# Altium schematic sheet RX_USB.SchDoc
size 431 x 279 mm; Organization: ORGANIZATION; Address1: ADDRESS 1; Address2: ADDRESS 2; Address3: ADDRESS 3; Address4: ADDRESS 4; Revision: -; SheetNumber: 1; SheetTotal: 6; ENG_APP_DATE: --/--/--; DSN_APP_DATE: --/--/--; CHK_APP_DATE: --/--/--
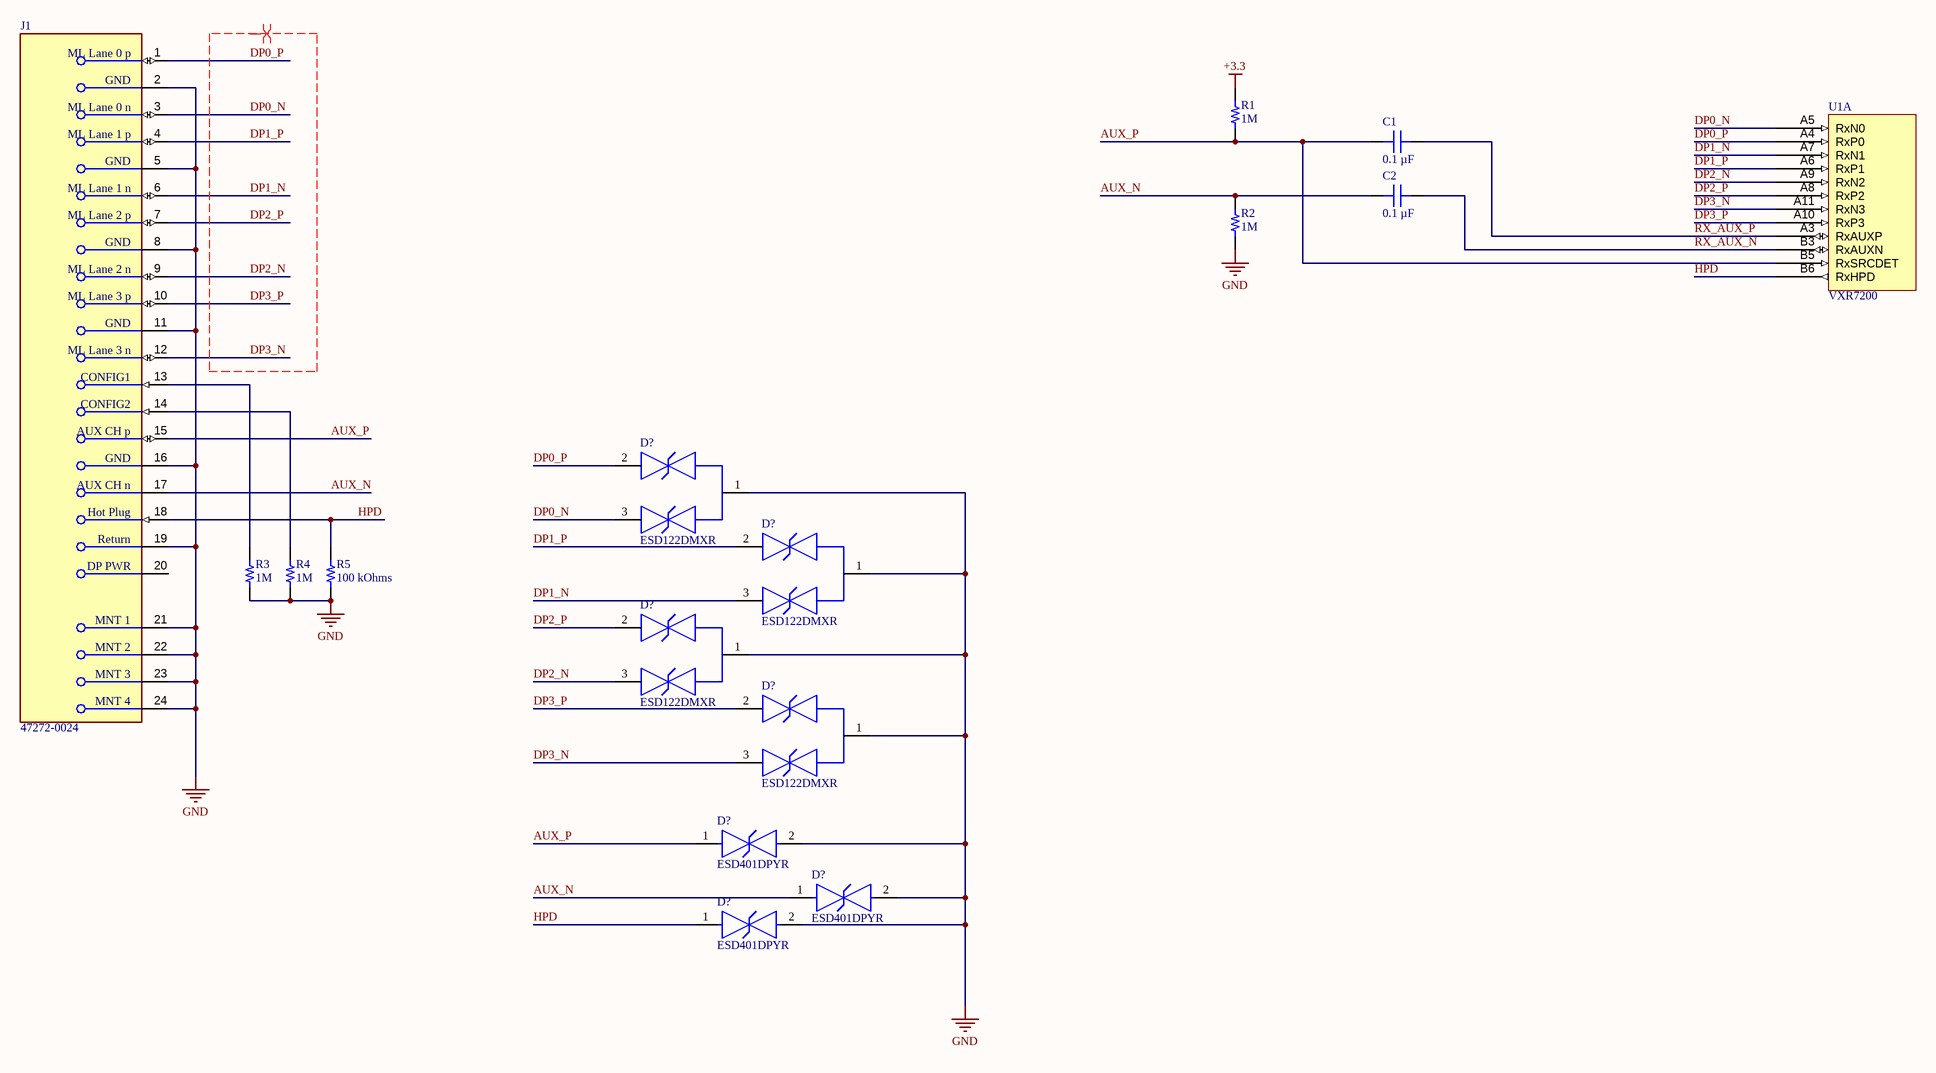
[diagram p0: RX_USB.SchDoc]

## Parts
(Parts that share a designator on the sheet are numbered #1, #2 ... from top to bottom, then left to right.)
C1  0.1 µF  [CAP 0201_0603]
C2  0.1 µF  [CAP 0201_0603]
D?#1  ESD122DMXR  [FP-DMX0003A-MFG]
D?#2  ESD122DMXR  [FP-DMX0003A-MFG]
D?#3  ESD122DMXR  [FP-DMX0003A-MFG]
D?#4  ESD122DMXR  [FP-DMX0003A-MFG]
D?#5  ESD401DPYR  [FP-DPY0002A-MFG]
D?#6  ESD401DPYR  [FP-DPY0002A-MFG]
D?#7  ESD401DPYR  [FP-DPY0002A-MFG]
J1  47272-0024  [FP-47272-0024-MFG]
R1  1M  [RES 0402_1005]
R2  1M  [RES 0402_1005]
R3  1M  [RES 0402_1005]
R4  1M  [RES 0402_1005]
R5  100 kOhms  [RES 0402_1005]
U1  VXR7200  [BGA121C50P11X11_600X600X90]  (part A of 9)

## Nets
+3.3: R1.2
GND: D?#1.1(GND) D?#2.1(GND) D?#3.1(GND) D?#4.1(GND) D?#5.2(GND) D?#6.2(GND) D?#7.2(GND) J1.2(GND) J1.5(GND) J1.8(GND) J1.11(GND) J1.16(GND) J1.19(Return) J1.21(MNT_1) J1.22(MNT_2) J1.23(MNT_3) J1.24(MNT_4) R2.1 R3.1 R4.1 R5.1
AUX_N: C2.1 D?#6.1(IO) J1.17(AUX_CH_n) R2.2
AUX_P: C1.1 D?#5.1(IO) J1.15(AUX_CH_p) R1.1 U1.B5(RxSRCDET)
DP0_N: D?#1.3(IO2) J1.3(ML_Lane_0_n) U1.A5(RxN0)
DP0_P: D?#1.2(IO1) J1.1(ML_Lane_0_p) U1.A4(RxP0)
DP1_N: D?#2.3(IO2) J1.6(ML_Lane_1_n) U1.A7(RxN1)
DP1_P: D?#2.2(IO1) J1.4(ML_Lane_1_p) U1.A6(RxP1)
DP2_N: D?#3.3(IO2) J1.9(ML_Lane_2_n) U1.A9(RxN2)
DP2_P: D?#3.2(IO1) J1.7(ML_Lane_2_p) U1.A8(RxP2)
DP3_N: D?#4.3(IO2) J1.12(ML_Lane_3_n) U1.A11(RxN3)
DP3_P: D?#4.2(IO1) J1.10(ML_Lane_3_p) U1.A10(RxP3)
HPD: D?#7.1(IO) J1.18(Hot_Plug) R5.2 U1.B6(RxHPD)
RX_AUX_N: C2.2 U1.B3(RxAUXN)
RX_AUX_P: C1.2 U1.A3(RxAUXP)
NetJ1_13: J1.13(CONFIG1) R3.2
NetJ1_14: J1.14(CONFIG2) R4.2

Not connected (* = marked no-connect by the designer): J1 20(DP_PWR)

## Layout directives
differential pair: DP0_N, DP0_P, DP1_N, DP1_P, DP2_N, DP2_P, DP3_N, DP3_P

## Notes on the sheet
- DWG. NO.
- REV.
- SHT.
- REVISION
- DESCRIPTION
- DATE
- APPROVED
- ENG:
- APPROVALS
- PROJECT
- DSN:
- CHK:
- REFERENCE DOCUMENTS
- PROJECT REVISION:
- TITLE
- SimulaVR
- DOCUMENT REVISION:
- DESIGN ITEM:
- BOM:
- FAB DWG:
- PCB DWG:
- ASSY DWG:
- SCALE:
- SIZE
- B
- CAGE CODE
- FILE NAME
- DWG NO.
- SHEET
- OF
- REV

## Library data of the parts
C1 C2 = GRM033R61E104KE14J: CAP CER 0.1UF 25V X5R 0201; manufacturer: Murata Electronics; Tolerance: ±10%; Part Number: GRM033R61E104KE14J; Value: 0.1 µF; Applications: General Purpose; Capacitance: 0.1 µF; componentlink1description: Datasheet; componentlink1url: https://search.murata.co.jp/Ceramy/image/img/A01X/G101/ENG/GRM033R61E104KE14-01.pdf; componentlink2description: DigiKey Link; componentlink2url: https://www.digikey.com/en/products/detail/murata-electronics/GRM033R61E104KE14J/4904732; Device Package: 0201 (0603 Metric); lastupdated: 3/4/2022 5:22:49 PM; Lifecycle Status: Active; Minimum Order: 1; Mounting Type: Surface Mount, MLCC; Operating Temperature: -55°C ~ 85°C; Package / Case: 0201 (0603 Metric); packaging: TapeAndReel; partid: 80; Part Status: Active; price: 0.01; series: GRM; Size / Dimension: 0.024" L x 0.012" W (0.60mm x 0.30mm); Supplier 1: DigiKey; Supplier Part Number 1: 490-14571-1-ND; Temperature Coefficient: X5R; Thickness (Max): 0.013" (0.33mm); Voltage - Rated: 25V
D?#1-D?#4 = CMP-04989-000013-1: TVS DIODE 3.6V 8.4V 3X2SON; Peak Pulse Power: 20W; Min Breakdown Voltage: 5.1V; Average Rectified Current: 10A; Element Configuration: Common Cathode; Number of Channels: 2; Max Reverse Voltage (DC): 100V; Interface: USB; Power Line Protection: No; Peak Pulse Current: 2.5A; Clamping Voltage: 8.4V; Min Operating Temperature: -40°C; Number of Pins: 3; Resistor Type: Zener; Mount: Through Hole; Case/Package: TO-220-3; Reverse Standoff Voltage: 3.6V; RoHS Compliant: Yes; Max Operating Temperature: 125°C; Number of Bidirectional Channels: 2; Packaging: Rail/Tube
D?#5-D?#7 = CMP-04989-000019-1: TVS DIODE 5.5V 24V 2X1SON; Number of Bidirectional Channels: 1; Interface: USB; Min Breakdown Voltage: 7.5V; Peak Pulse Power: 67W; Power Line Protection: No; Peak Pulse Current: 4.5A; Mount: Surface Mount; Reverse Standoff Voltage: 5.5V; Clamping Voltage: 24V; Number of Channels: 1; Case/Package: 0402; Case Code (Metric): 1006; Packaging: Tape and Reel; Max Operating Temperature: 125°C; Resistor Type: Zener; Case Code (Imperial): 0402; Min Operating Temperature: -40°C; RoHS Compliant: Yes
J1 = CMP-1704-00002-4: CONN RCPT DISPLAYPORT 20P SMD RA; Manufacturer: Molex; Shielding: true; Current Rating: 0.5A; Number Of Contacts: 20; Voltage Rating: 40V; Is Female: yes; Pitch: 0.5mm; Conn Orientation: Right Angle; Description: HDMI, Displayport & DVI Connectors .5MM RA SMT RECPT 30AU W/LATCH HLS; Temperature: -20°C to +85°C; Footprint Url: https://www.molex.com/pdm_docs/sd/472720024_sd.pdf; Height: 6.9mm; Temperature Range High: +85°C; Octopart: https://octopart.com/47272-0024-molex-10251301; Category: Conn; RoHS: TRUE; Mouser Description: Conn Display Port RCP 20 POS 0.5mm Solder RA SMD 20 Terminal 1 Port DisplayPort Embossed T/R; Device Class L3: unset; Device Class L1: Connectors; ComponentLink2Description: Datasheet; Lead Free: Yes; Contact Material: Gold,Tin; Manufacturer Part Number: 47272-0024; ComponentLink2URL: https://www.molex.com/webdocs/datasheets/pdf/en-us/0472720024_IO_CONNECTORS.pdf; Digikey Description: CONN RCPT DISPLAYPORT 20P SMD RA; Automotive: No; Package: 0; Temperature Range Low: -20°C; Device Class L2: Audio / Video Connectors
R1-R4 = AC0402JR-071ML: RES SMD 1M OHM 5% 1/16W 0402; Manufacturer: Yageo; Power (Watts): 0.063W, 1/16W; Resistance: 1 MOhms; Temperature Coefficient: ±100ppm/°C; Part Number: AC0402JR-071ML; Value: 1M; ComponentLink1Description: Datasheet; ComponentLink1URL: https://www.yageo.com/upload/media/product/productsearch/datasheet/rchip/PYu-AC_51_RoHS_L_7.pdf; ComponentLink2Description: DigiKey Link; ComponentLink2URL: https://www.digikey.com/en/products/detail/yageo/AC0402JR-071ML/5895610; Composition: Thick Film; Device Package: 0402 (1005 Metric); Features: Automotive AEC-Q200, Moisture Resistant; Height - Seated (Max): 0.015" (0.37mm); LastUpdated: 3/4/2022 5:41:14 PM; Lifecycle Status: Active; Minimum Order: 1; Number of Terminations: 2; Operating Temperature: -55°C ~ 155°C; Package / Case: 0402 (1005 Metric); Packaging: CutTape; PartId: 3387; Part Status: Active; Price: 0.01; Ratings: AEC-Q200; Series: AC; Size / Dimension: 0.039" L x 0.020" W (1.00mm x 0.50mm); Supplier 1: DigiKey; Supplier Part Number 1: YAG3526CT-ND; Supplier Device Package: 0402; Tolerance: ±5%
R5 = AC0402JR-07100KL: RES SMD 100K OHM 5% 1/16W 0402; Manufacturer: Yageo; Power (Watts): 0.063W, 1/16W; Temperature Coefficient: ±100ppm/°C; Part Number: AC0402JR-07100KL; Value: 100 kOhms; ComponentLink1Description: Datasheet; ComponentLink1URL: https://www.yageo.com/upload/media/product/productsearch/datasheet/rchip/PYu-AC_51_RoHS_L_7.pdf; ComponentLink2Description: DigiKey Link; ComponentLink2URL: https://www.digikey.com/en/products/detail/yageo/AC0402JR-07100KL/5895569; Composition: Thick Film; Device Package: 0402 (1005 Metric); Features: Automotive AEC-Q200, Moisture Resistant; Height - Seated (Max): 0.015" (0.37mm); LastUpdated: 3/4/2022 5:41:14 PM; Lifecycle Status: Active; Minimum Order: 1; Number of Terminations: 2; Operating Temperature: -55°C ~ 155°C; Package / Case: 0402 (1005 Metric); Packaging: CutTape; PartId: 3380; Part Status: Active; Price: 0.01; Ratings: AEC-Q200; Resistance: 100 kOhms; Series: AC; Size / Dimension: 0.039" L x 0.020" W (1.00mm x 0.50mm); Supplier 1: DigiKey; Supplier Part Number 1: YAG3515CT-ND; Supplier Device Package: 0402; Tolerance: ±5%
U1 = CMP-015-00008-3: VXR7200 DP to MIPI-DSI bridge